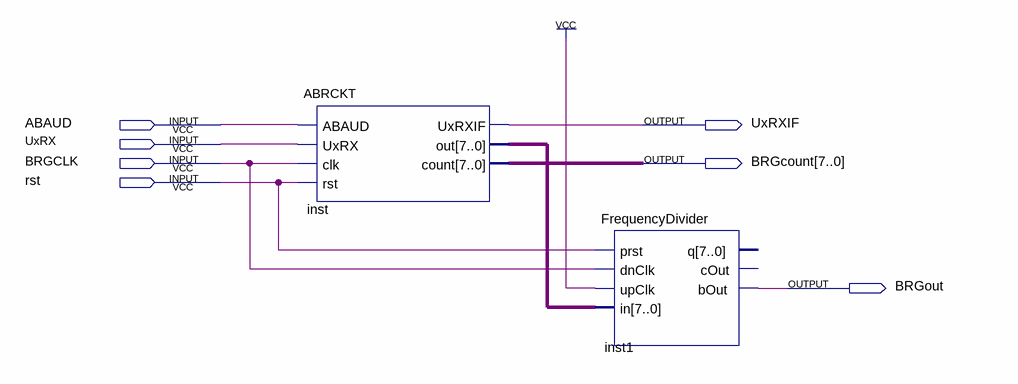
[diagram p0: schematic sheet]
// Quartus schematic BRGCKT.bdf as structural Verilog: 2 symbols, 7 pins
module BRGCKT (
  input  ABAUD,
  input  UxRX,
  input  BRGCLK,
  input  rst,
  output UxRXIF,
  output [7:0] BRGcount,
  output BRGout
);

  wire [7:0] inst_out;

  ABRCKT inst (.ABAUD(ABAUD), .UxRX(UxRX), .clk(BRGCLK), .rst(rst), .UxRXIF(UxRXIF), .out(inst_out), .count(BRGcount));
  FrequencyDivider inst1 (.prst(rst), .dnClk(BRGCLK), .upClk(1'b1), .in(inst_out), .bOut(BRGout));  // open: q, cOut
endmodule
